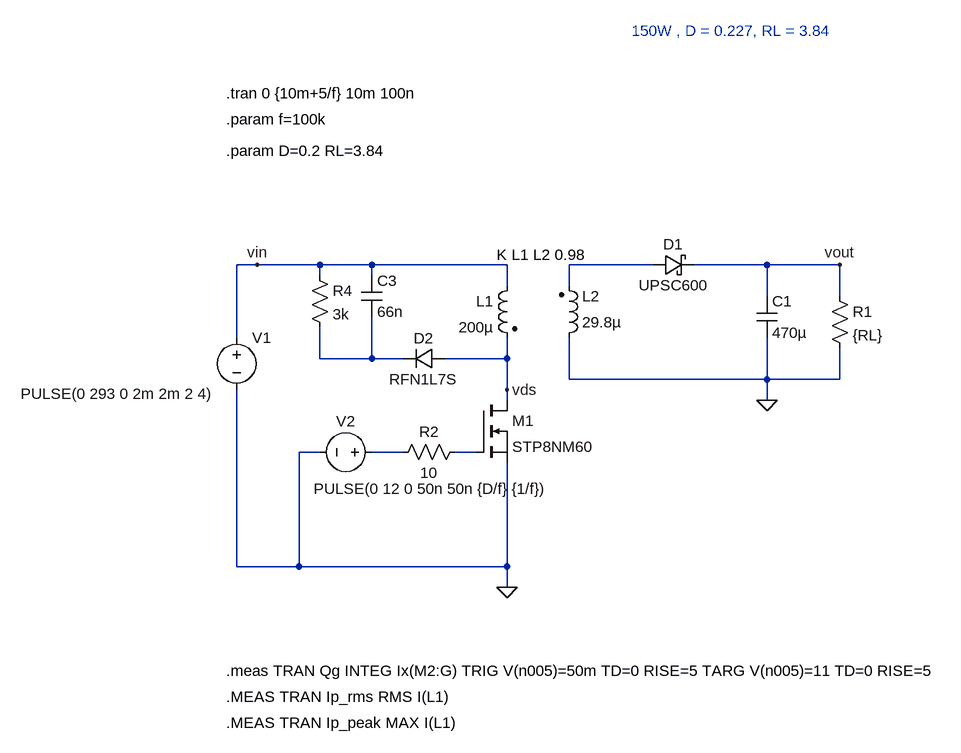
[diagram p0: schematic flyback_simplified.asc]
flyback_simplified.asc, the LTspice schematic file:
Version 4
SHEET 1 4796 96456
WIRE -1024 -336 -1056 -336
WIRE -928 -336 -1024 -336
WIRE -848 -336 -928 -336
WIRE -640 -336 -848 -336
WIRE -416 -336 -544 -336
WIRE -240 -336 -352 -336
WIRE -128 -336 -240 -336
WIRE -928 -320 -928 -336
WIRE -848 -320 -848 -336
WIRE -640 -304 -640 -336
WIRE -544 -304 -544 -336
WIRE -240 -288 -240 -336
WIRE -128 -288 -128 -336
WIRE -1056 -224 -1056 -336
WIRE -928 -192 -928 -240
WIRE -848 -192 -848 -256
WIRE -848 -192 -928 -192
WIRE -800 -192 -848 -192
WIRE -640 -192 -640 -224
WIRE -640 -192 -736 -192
WIRE -544 -160 -544 -224
WIRE -240 -160 -240 -224
WIRE -240 -160 -544 -160
WIRE -128 -160 -128 -208
WIRE -128 -160 -240 -160
WIRE -640 -144 -640 -192
WIRE -640 -128 -640 -144
WIRE -240 -128 -240 -160
WIRE -928 -48 -960 -48
WIRE -800 -48 -848 -48
WIRE -688 -48 -720 -48
WIRE -1056 128 -1056 -144
WIRE -960 128 -960 -48
WIRE -960 128 -1056 128
WIRE -640 128 -640 -32
WIRE -640 128 -960 128
WIRE -640 160 -640 128
FLAG -640 160 0
FLAG -1024 -336 vin
FLAG -240 -128 0
FLAG -640 -144 vds
FLAG -128 -336 vout
SYMBOL cap -256 -288 R0
SYMATTR InstName C1
SYMATTR Value 470µ
SYMBOL res -144 -304 R0
SYMATTR InstName R1
SYMATTR Value {RL}
SYMBOL voltage -1056 -240 R0
WINDOW 123 0 0 Left 0
WINDOW 39 0 0 Left 0
WINDOW 3 -332 102 Left 2
SYMATTR Value PULSE(0 293 0 2m 2m 2 4)
SYMATTR InstName V1
SYMBOL voltage -832 -48 R90
WINDOW 0 -32 56 VBottom 2
WINDOW 3 41 -75 VTop 2
WINDOW 123 0 0 Left 0
WINDOW 39 0 0 Left 0
SYMATTR InstName V2
SYMATTR Value PULSE(0 12 0 50n 50n {D/f} {1/f})
SYMBOL res -704 -64 R90
WINDOW 0 0 56 VBottom 2
WINDOW 3 32 56 VTop 2
SYMATTR InstName R2
SYMATTR Value 10
SYMBOL ind2 -624 -320 M0
SYMATTR InstName L1
SYMATTR Value 200µ
SYMATTR Type ind
SYMBOL ind2 -560 -208 M180
WINDOW 0 36 80 Left 2
WINDOW 3 36 40 Left 2
SYMATTR InstName L2
SYMATTR Value 29.8µ
SYMATTR Type ind
SYMBOL nmos -688 -128 R0
SYMATTR InstName M1
SYMATTR Value STP8NM60
SYMBOL schottky -416 -320 R270
WINDOW 0 32 32 VTop 2
WINDOW 3 0 32 VBottom 2
SYMATTR InstName D1
SYMATTR Value UPSC600
SYMATTR Description Diode
SYMATTR Type diode
SYMBOL res -944 -336 R0
SYMATTR InstName R4
SYMATTR Value 3k
SYMBOL cap -864 -320 R0
SYMATTR InstName C3
SYMATTR Value 66n
SYMBOL diode -736 -208 R90
WINDOW 0 0 32 VBottom 2
WINDOW 3 32 32 VTop 2
SYMATTR InstName D2
SYMATTR Value RFN1L7S
TEXT -656 -352 Left 2 !K L1 L2 0.98
TEXT -1072 -600 Left 2 !.tran 0 {10m+5/f} 10m 100n
TEXT -1072 -560 Left 2 !.param f=100k
TEXT -1072 -512 Left 2 !.param D=0.2 RL=3.84
TEXT -1072 288 Left 2 !.meas TRAN Qg INTEG Ix(M2:G) TRIG V(n005)=50m TD=0 RISE=5 TARG V(n005)=11 TD=0 RISE=5
TEXT -1072 328 Left 2 !.MEAS TRAN Ip_rms RMS I(L1)
TEXT -1072 368 Left 2 !.MEAS TRAN Ip_peak MAX I(L1)
TEXT -448 -696 Left 2 ;150W , D = 0.227, RL = 3.84

The netlist it stands for:
* flyback_simplified.asc
C1 vout 0 470µ
R1 vout 0 {RL}
V1 vin 0 PULSE(0 293 0 2m 2m 2 4)
V2 N003 0 PULSE(0 12 0 50n 50n {D/f} {1/f})
R2 N004 N003 10
L1 vin vds 200µ
L2 0 N001 29.8µ
M1 vds N004 0 0 STP8NM60
D1 N001 vout UPSC600
R4 vin N002 3k
C3 vin N002 66n
D2 vds N002 RFN1L7S
.model D D
.lib standard.dio
.model NMOS NMOS
.model PMOS PMOS
.lib standard.mos
K L1 L2 0.98
.tran 0 {10m+5/f} 10m 100n
.param f=100k
.param D=0.2 RL=3.84
.meas TRAN Qg INTEG Ix(M2:G) TRIG V(n005)=50m TD=0 RISE=5 TARG V(n005)=11 TD=0 RISE=5
.MEAS TRAN Ip_rms RMS I(L1)
.MEAS TRAN Ip_peak MAX I(L1)
* 150W , D = 0.227, RL = 3.84
.backanno
.end

* Results of the author's LTspice run, read from the files saved beside the schematic
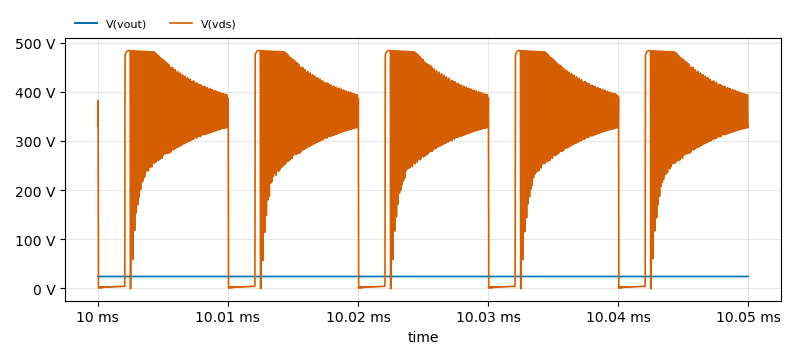
[diagram p1: Transient Analysis of flyback_simplified.asc, plotted from the saved traces]
* Transient Analysis, 1 run:
*   V(vout): min 23.88 V, max 23.91 V, average 23.9 V, rms 23.9 V, last 23.91 V
*   V(vds): min -1.176 V, max 484.3 V, average 293.4 V, rms 335.4 V, last 337.1 V